# Altium schematic sheet Power_Domain.SchDoc: Power Domain
size A4; DocumentNumber: 11; SheetNumber: 11; SheetTotal: 31
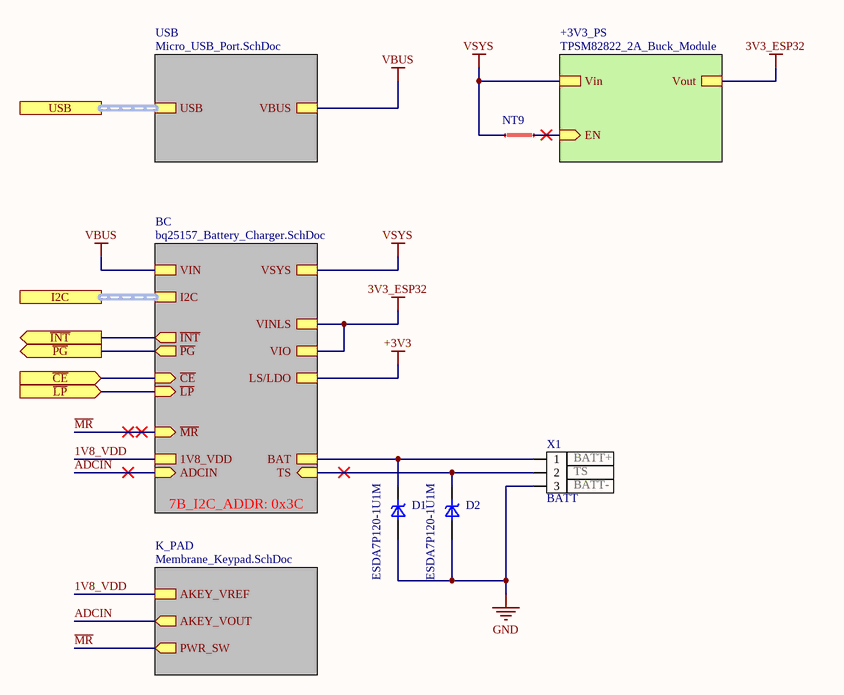
[diagram p0: Power_Domain.SchDoc]

## Parts
D1  ESDA7P120-1U1M  [ST_QFN_1610]
D2  ESDA7P120-1U1M  [ST_QFN_1610]
NT9  Net Tie  [Net Tie 1x3mm]  (value not drawn)  (net tie, no BOM)
X1  BATT  pin_1: BATT+  pin_2: TS  pin_3: BATT-  [JST_S3B-ZR-SM4A-TF]

## Sub-sheets
+3V3_PS = TPSM82822_2A_Buck_Module: Vout, Vin, EN (in)
BC = bq25157_Battery_Charger.SchDoc: VIN, VSYS, BAT, TS (in), ~{CE} (in), ~{LP} (in), ADCIN (in), ~{MR} (in), ~{INT} (out), ~{PG} (out), I2C (harness I2C), LS/LDO, VINLS, VIO, 1V8_VDD  | 7B_I2C_ADDR: 0x3C
K_PAD = Membrane_Keypad.SchDoc: PWR_SW (out), AKEY_VREF, AKEY_VOUT (out)
USB = Micro_USB_Port.SchDoc: USB (harness USB), VBUS

## Ports
I2C (harness I2C), USB (harness USB), ~{CE} (in), ~{INT} (out), ~{LP} (in), ~{PG} (out)

## Nets
3V3_ESP32: sheet BC/VINLS, sheet BC/VIO, sheet +3V3_PS/Vout
+3V3: sheet BC/LS/LDO
GND: D1.2(A) D2.2(A) X1.3
VBUS: sheet USB/VBUS, sheet BC/VIN
VSYS: NT9.2 ; sheet BC/VSYS, sheet +3V3_PS/Vin
1V8_VDD: sheet BC/1V8_VDD, sheet K_PAD/AKEY_VREF
~{CE}: port ~{CE}, sheet BC/~{CE}
~{INT}: port ~{INT}, sheet BC/~{INT}
~{LP}: port ~{LP}, sheet BC/~{LP}
~{MR}: sheet BC/~{MR}, sheet K_PAD/PWR_SW
~{PG}: port ~{PG}, sheet BC/~{PG}
ADCIN: sheet BC/ADCIN, sheet K_PAD/AKEY_VOUT
NetD1_1: D1.1(K) X1.1 ; sheet BC/BAT
NetD2_1: D2.1(K) X1.2 ; sheet BC/TS
NetNT9_1: NT9.1 ; sheet +3V3_PS/EN

## Buses and harness runs
harness port I2C = sheet BC/I2C
harness port USB = sheet USB/USB

## Notes on the sheet
- Title
- Size:
- Date:
- A4
- Number:
- Time:
- Revision:
- Sheet
- of
- File:

## Library data of the parts
D1 D2 = TVS DIODE ESDA7P120-1U1M 5.5V 11.5V 1610: 11.5V Clamp 120A (8/20µs) Ipp Tvs Diode Surface Mount 1610; Manufacturer: STMicroelectronics; Reverse Standoff Voltage: 5.5V; Number of Unidirectional Channels: 1; Min Breakdown Voltage: 6.4V; Peak Pulse Power: 1.4kW; Power Line Protection: No; Supplier 1: Digi-Key; Manufacturer Part Number: ESDA7P120-1U1M; Stock 1: 15775; Pricing 1: 1=0.35, 10=0.287, 25=0.2624, 100=0.1647, 250=0.1629, 500=0.1525, 1000=0.1037, 2500=0.0994 (USD); Packaging: Cut Tape; ComponentLink1URL: http://www.st.com/content/ccc/resource/technical/document/datasheet/group3/5e/7c/5d/76/3f/de/45/35/DM00359316/files/DM00359316.pdf/jcr:content/translations/en.DM00359316.pdf?src-supplier=Digi-Key; ComponentLink1Description: http://www.st.com/content/ccc/resource/technical/document/datasheet/group3/5e/7c/5d/76/3f/de/45/35/DM00359316/files/DM00359316.pdf/jcr:content/translations/en.DM00359316.pdf?src-supplier=Digi-Key; Supplier Part Number 1: 497-17159-1-ND; Mount: Surface Mount; Case/Package: 0603; Case Code (Imperial): 0603; Case Code (Metric): 1610; Min Operating Temperature: -55°C; Max Operating Temperature: 150°C; Composition: Zener; Clamping Voltage: 11.5V; Peak Pulse Current: 120A; ComponentLink2URL: http://www.farnell.com/datasheets/2815837.pdf?src-supplier=Newark; ComponentLink2Description: http://www.farnell.com/datasheets/2815837.pdf?src-supplier=Newark; ComponentLink3URL: http://www.farnell.com/datasheets/2815837.pdf?src-supplier=Farnell; ComponentLink3Description: http://www.farnell.com/datasheets/2815837.pdf?src-supplier=Farnell; ComponentLink4URL: http://www.farnell.com/datasheets/2815837.pdf?src-supplier=Element14; ComponentLink4Description: http://www.farnell.com/datasheets/2815837.pdf?src-supplier=Element14
NT9 = Net Tie Line: ClassName: Net Tie
X1 = CONN HEADER TH R/A 3POS 1.5MM: Connector Header Through Hole, Right Angle 3 position 0.059" (1.50mm); Manufacturer: JST; Manufacturer Part Number: S3B-ZR(LF)(SN); Number of Positions: 3; Connector Type: Male Pin; Voltage Rating: 50V; Contact Resistance: 30mR; Max Current Rating: 1A; Gender: Male; Pitch: 1.5mm; Body Plating: Tin; Insulation Resistance: 500MR; Panel Thickness: 3.5mm; Supplier 1: Digi-Key; Stock 1: 0; Mount: Through Hole; Number of Pins: 3; Color: Natural,White; Contact Plating: Tin,Copper; Contact Material: Brass,Copper,Tin; Housing Color: Beige; Housing Material: Polyamide; Min Operating Temperature: -25°C; Max Operating Temperature: 85°C; Packaging: Bulk; Number of Rows: 1; Termination: Press-Fit; Current Rating: 1A; Fastening Type: Detent; Max Voltage Rating (AC): 50V; Number of Contacts: 3; Orientation: Right Angle; Length: 6mm; Height: 7.2mm; Width: 3.5mm; Depth: 6mm; Contact Mating Length: 0.094inch; Lead Free: Lead Free; ComponentLink1URL: http://www.jst-mfg.com/product/pdf/eng/eZH.pdf?src-supplier=Digi-Key; ComponentLink1Description: http://www.jst-mfg.com/product/pdf/eng/eZH.pdf?src-supplier=Digi-Key; ComponentLink2URL: https://www.verical.com/server-webapp/html/getDatasheet?partID=722697&src-supplier=Verical; ComponentLink2Description: https://www.verical.com/server-webapp/html/getDatasheet?partID=722697&src-supplier=Verical; ComponentLink3URL: http://www.produktinfo.conrad.com/datenblaetter/725000-749999/741155-da-01-en-STIFTLEISTE_GEWINKELT_3_POL_RM1_5.pdf?src-supplier=Conrad; ComponentLink3Description: http://www.produktinfo.conrad.com/datenblaetter/725000-749999/741155-da-01-en-STIFTLEISTE_GEWINKELT_3_POL_RM1_5.pdf?src-supplier=Conrad; Supplier Part Number 1: 455-1670-ND; Pricing 1: 1=0.2, 10=0.184, 100=0.1274, 500=0.1078, 1000=0.0882, 5000=0.0784, 10000=0.071 (USD); Material: Nylon; Voltage Rating (AC): 50V; Voltage Rating (DC): 50V; Lead Pitch: 1.5mm; REACH SVHC: No SVHC; Flammability Rating: UL94 V-0